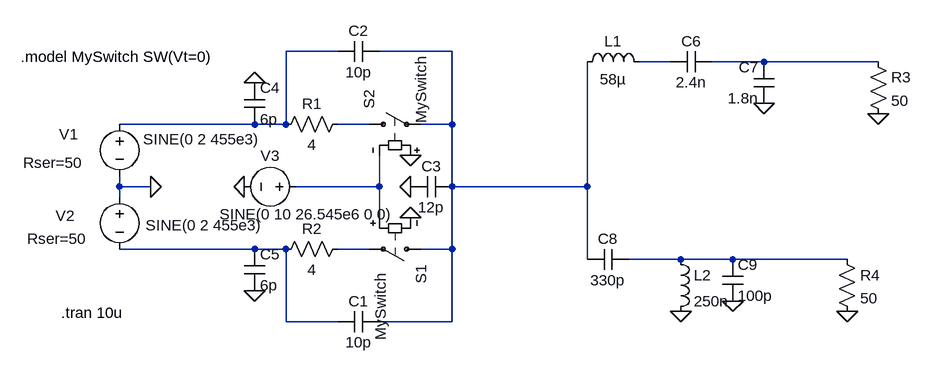
[diagram p0: schematic multiplexer_as_mixer.asc]
multiplexer_as_mixer.asc, the LTspice schematic file:
Version 4
SHEET 1 1032 680
WIRE 144 -1392 64 -1392
WIRE 320 -1392 208 -1392
WIRE 656 -1376 608 -1376
WIRE 800 -1376 720 -1376
WIRE 976 -1376 800 -1376
WIRE 16 -1280 -192 -1280
WIRE 64 -1280 64 -1392
WIRE 64 -1280 16 -1280
WIRE 192 -1280 144 -1280
WIRE 320 -1280 320 -1392
WIRE 320 -1280 272 -1280
WIRE -192 -1184 -192 -1200
WIRE -144 -1184 -192 -1184
WIRE 208 -1184 208 -1232
WIRE 208 -1184 80 -1184
WIRE 320 -1184 320 -1280
WIRE 528 -1184 528 -1376
WIRE 528 -1184 320 -1184
WIRE -192 -1168 -192 -1184
WIRE 208 -1136 208 -1184
WIRE 16 -1088 -192 -1088
WIRE 64 -1088 16 -1088
WIRE 192 -1088 144 -1088
WIRE 320 -1088 320 -1184
WIRE 320 -1088 272 -1088
WIRE 528 -1072 528 -1184
WIRE 672 -1072 592 -1072
WIRE 752 -1072 672 -1072
WIRE 928 -1072 752 -1072
WIRE 64 -976 64 -1088
WIRE 144 -976 64 -976
WIRE 320 -976 320 -1088
WIRE 320 -976 208 -976
FLAG 256 -1232 0
FLAG 256 -1136 0
FLAG 256 -1184 0
FLAG 16 -1024 0
FLAG 16 -1344 0
FLAG -144 -1184 0
FLAG 0 -1184 0
FLAG 800 -1312 0
FLAG 976 -1296 0
FLAG 752 -1008 0
FLAG 672 -992 0
FLAG 928 -992 0
SYMBOL sw 288 -1088 R90
WINDOW 3 38 78 Left 2
SYMATTR InstName S1
SYMATTR Value MySwitch
SYMBOL sw 176 -1280 R270
WINDOW 3 1 96 Left 2
SYMATTR InstName S2
SYMATTR Value MySwitch
SYMBOL res 160 -1296 R90
WINDOW 0 0 56 VBottom 2
WINDOW 3 32 56 VTop 2
SYMATTR InstName R1
SYMATTR Value 4
SYMBOL res 160 -1104 R90
WINDOW 0 0 56 VBottom 2
WINDOW 3 32 56 VTop 2
SYMATTR InstName R2
SYMATTR Value 4
SYMBOL cap 144 -960 R270
WINDOW 0 32 32 VTop 2
WINDOW 3 0 32 VBottom 2
SYMATTR InstName C1
SYMATTR Value 10p
SYMBOL cap 208 -1408 R90
WINDOW 0 0 32 VBottom 2
WINDOW 3 32 32 VTop 2
SYMATTR InstName C2
SYMATTR Value 10p
SYMBOL cap 320 -1200 R90
WINDOW 0 0 32 VBottom 2
WINDOW 3 32 32 VTop 2
SYMATTR InstName C3
SYMATTR Value 12p
SYMBOL cap 0 -1344 R0
SYMATTR InstName C4
SYMATTR Value 6p
SYMBOL cap 0 -1088 R0
SYMATTR InstName C5
SYMATTR Value 6p
SYMBOL voltage -192 -1296 R0
WINDOW 0 -93 31 Left 2
WINDOW 3 36 39 Left 2
WINDOW 123 0 0 Left 0
WINDOW 39 -148 75 Left 2
SYMATTR InstName V1
SYMATTR Value SINE(0 2 455e3)
SYMATTR SpiceLine Rser=50
SYMBOL voltage -192 -1184 R0
WINDOW 0 -98 45 Left 2
WINDOW 3 40 59 Left 2
WINDOW 123 0 0 Left 0
WINDOW 39 -142 80 Left 2
SYMATTR InstName V2
SYMATTR Value SINE(0 2 455e3)
SYMATTR SpiceLine Rser=50
SYMBOL voltage 96 -1184 R90
WINDOW 0 -32 56 VBottom 2
WINDOW 3 27 0 VTop 2
WINDOW 123 0 0 Left 0
WINDOW 39 0 0 Left 0
SYMATTR InstName V3
SYMATTR Value SINE(0 10 26.545e6 0 0)
SYMBOL ind 512 -1360 R270
WINDOW 0 32 56 VTop 2
WINDOW 3 5 56 VBottom 2
SYMATTR InstName L1
SYMATTR Value 58µ
SYMBOL cap 720 -1392 R90
WINDOW 0 0 32 VBottom 2
WINDOW 3 32 32 VTop 2
SYMATTR InstName C6
SYMATTR Value 2.4n
SYMBOL cap 816 -1312 R180
WINDOW 0 24 56 Left 2
WINDOW 3 24 8 Left 2
SYMATTR InstName C7
SYMATTR Value 1.8n
SYMBOL res 960 -1392 R0
SYMATTR InstName R3
SYMATTR Value 50
SYMBOL cap 592 -1088 R90
WINDOW 0 0 32 VBottom 2
WINDOW 3 32 32 VTop 2
SYMATTR InstName C8
SYMATTR Value 330p
SYMBOL ind 656 -1088 R0
SYMATTR InstName L2
SYMATTR Value 250n
SYMBOL cap 736 -1072 R0
SYMATTR InstName C9
SYMATTR Value 100p
SYMBOL res 912 -1088 R0
SYMATTR InstName R4
SYMATTR Value 50
TEXT -344 -1384 Left 2 !.model MySwitch SW(Vt=0)
TEXT -282 -990 Left 2 !.tran 10u

The netlist it stands for:
* multiplexer_as_mixer.asc
S1 N002 N008 N006 0 MySwitch
S2 N005 N002 0 N006 MySwitch
R1 N005 N001 4
R2 N008 N007 4
C1 N007 N002 10p
C2 N002 N001 10p
C3 N002 0 12p
C4 0 N001 6p
C5 N007 0 6p
V1 N001 0 SINE(0 2 455e3) Rser=50
V2 0 N007 SINE(0 2 455e3) Rser=50
V3 N006 0 SINE(0 10 26.545e6 0 0)
L1 N002 N003 58µ
C6 N004 N003 2.4n
C7 0 N004 1.8n
R3 N004 0 50
C8 N009 N002 330p
L2 N009 0 250n
C9 N009 0 100p
R4 N009 0 50
.model MySwitch SW(Vt=0)
.tran 10u
.backanno
.end